# Altium schematic sheet Flash.SchDoc
size B; SheetNumber: 4; SheetTotal: 8
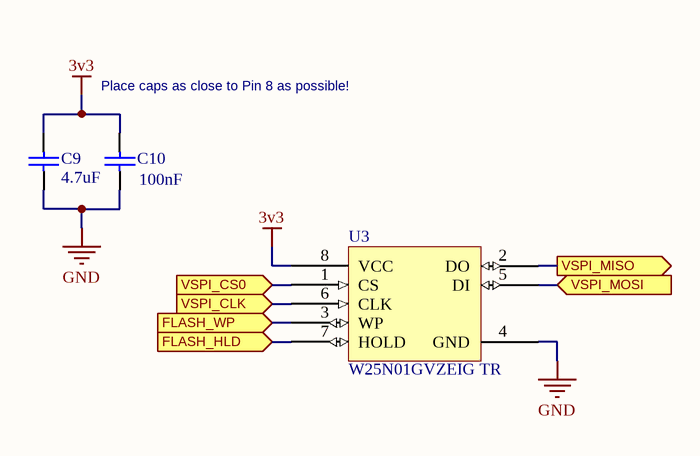
[diagram p0: Flash.SchDoc]

## Parts
C9  Capacitance: 4.7uF  [Capacitor_0402]  (hidden comment: GRM155R60J475ME87D)
C10  Capacitance: 100nF  [Capacitor_0402]  (hidden comment: GRM155R71E104KE14D)
U3  W25N01GVZEIG TR  [W25N01GVZEIG TR-Footprint-1]

## Ports
FLASH_HLD (in), FLASH_WP (in), VSPI_CLK (in), VSPI_CS0 (in), VSPI_MISO (out), VSPI_MOSI (in)

## Nets
3v3: C9.2 C10.2 U3.8(VCC)
GND: C9.1 C10.1 U3.4(GND)
FLASH_HLD: U3.7(HOLD) ; port FLASH_HLD
FLASH_WP: U3.3(WP) ; port FLASH_WP
VSPI_CLK: U3.6(CLK) ; port VSPI_CLK
VSPI_CS0: U3.1(CS) ; port VSPI_CS0
VSPI_MISO: U3.2(DO) ; port VSPI_MISO
VSPI_MOSI: U3.5(DI) ; port VSPI_MOSI

## Notes on the sheet
- Place caps as close to Pin 8 as possible!

## Library data of the parts
C9 = CMP-00000-1: 6.3V 4.7uF X5R ±20% 0402 Multilayer Ceramic Capacitors MLCC - SMD/SMT ROHS; Thickness: 0.022inch; Min Operating Temperature: -55°C; Case Code (Metric): 1005; Depth: 0.5mm; Tolerance: 20%; Width: 0.02inch; Series: GRM; Length: 1mm; Height: 0.5mm; Lead Free: Lead Free; Dielectric: X5R; Construction: Flat; REACH SVHC: No SVHC; Mount: Surface Mount; Radiation Hardening: No; Voltage Rating: 6.3V; RoHS Compliant: Yes; Packaging: Tape and Reel; Voltage Rating (DC): 6.3V; Package Quantity: 1; Max Operating Temperature: 85°C; Case Code (Imperial): 0402
C10 = CMP-001-00084-3: Chip Capacitor 100nF 0402 25V X7R
U3 = CMP-010-00028-1: 1Gb NAND Flash Memory With dual/Quad SPI And Continuous Read